# Altium schematic sheet 5R_Supply.doc.SchDoc: 5R Supply
size OrCAD A; DocumentNumber: LM-008; Revision: C; SheetNumber: 3; SheetTotal: 6
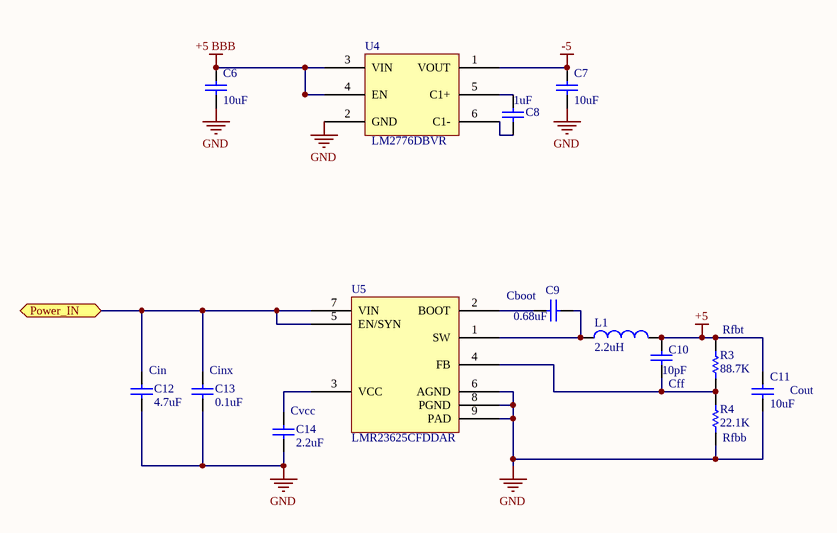
[diagram p0: 5R_Supply.doc.SchDoc]

## Parts
C6  10uF  [CAPC0805(2012)145_N]
C7  10uF  [CAPC0805(2012)145_N]
C8  1uF  [CAPC0805(2012)145_N]
C9  0.68uF  [1608[0603]]
C10  10pF  [CAPC0805(2012)145_N]
C11  10uF  [CAPC0805(2012)145_N]
C12  4.7uF  [C1210]
C13  0.1uF  [1608[0603]]
C14  2.2uF  [1608[0603]]
L1  2.2uH  [PA4332]
R3  88.7K  [RESC0805(2012)_M]
R4  22.1K  [RESC0805(2012)_M]
U4  LM2776DBVR  [LM2776DBVR]
U5  LMR23625CFDDAR  [LMR23625CDDAR]

## Ports
Power_IN

## Nets
+5: C10.1 C11.1 L1.2 R3.2
+5 BBB: C6.1 U4.3(VIN) U4.4(EN)
-5: C7.1 U4.1(VOUT)
GND: C6.2 C7.2 C11.2 C12.1 C13.1 C14.1 R4.1 U4.2(GND) U5.6(AGND) U5.8(PGND) U5.9(PAD)
Power_IN: C12.2 C13.2 U5.5(EN/SYN) U5.7(VIN) ; port Power_IN
NetC8_1: C8.1 U4.5(C1+)
NetC8_2: C8.2 U4.6(C1-)
NetC9_1: C9.1 U5.2(BOOT)
NetC9_2: C9.2 L1.1 U5.1(SW)
NetC10_2: C10.2 R3.1 R4.2 U5.4(FB)
NetC14_2: C14.2 U5.3(VCC)

## Notes on the sheet
- (near C9) Cboot
- (near R3) Rfbt
- (near C12) Cin
- (near C13) Cinx
- (near C10) Cff
- (near C11) Cout
- (near C14) Cvcc
- (near R4) Rfbb
- Title
- Size:
- Date:
- Orcad A
- Number:
- Time:
- Revision:
- Sheet
- of
- ZLS Corporation
- 7801 North Lamar Blvd.
- Suite E-184
- Austin, Texas 78752  USA
- (512) 453-0288
- File:

## Library data of the parts
C6 C7 C11 = CMP-1036-04795-1: CAP CER 10UF 16V X6S 0805; Manufacturer: TDK Corporation; Manufacturer Part Number: C2012X6S1C106K085AC; Tolerance: ±10%; Notification: Current market demand for these product types have resulted in fluctuating and extending lead times. Lead times may differ.; Supplier 1: Digi-Key; Supplier Part Number 1: 445-14483-6-ND; RoHS: RoHS Compliant; Category: Capacitors; Stock 1: 0; Pricing 1: 1=0.38, 10=0.259, 100=0.1466, 500=0.1035, 1000=0.09056 (USD); Packaging: Digi-Reel®; Part Status: Active; Voltage - Rated: 16V; Temperature Coefficient: X6S; Operating Temperature: -55°C ~ 105°C; Features: Low ESL; Ratings: -; Applications: General Purpose; Failure Rate: -; Mounting Type: Surface Mount, MLCC; Package / Case: 0805 (2012 Metric); Size / Dimension: 0.079" L x 0.049" W (2.00mm x 1.25mm); Height - Seated (Max): -; Thickness (Max): 0.039" (1.00mm); Lead Spacing: -; Lead Style: -; ComponentLink1URL: https://product.tdk.com/info/en/catalog/datasheets/mlcc_commercial_general_en.pdf; ComponentLink1Description: https://product.tdk.com/info/en/catalog/datasheets/mlcc_commercial_general_en.pdf
C8 = CMP-1036-04795-1: CAP CER 1UF 25V X7R 0805; Manufacturer: Yageo; Manufacturer Part Number: CC0805KKX7R6BB105; Tolerance: ±10%; Voltage - Rated: 10V; Notification: Current market demand for these product types have resulted in fluctuating and extending lead times. Lead times may differ.; Supplier 1: Digi-Key; Supplier Part Number 1: 311-1458-6-ND; RoHS: RoHS Compliant; Category: Capacitors; Stock 1: 30000; Pricing 1: 1=0.25, 10=0.168, 100=0.0852, 500=0.0583, 1000=0.05158 (USD); Packaging: Digi-Reel®; Part Status: Active; Temperature Coefficient: X7R; Operating Temperature: -55°C ~ 125°C; Features: -; Ratings: -; Applications: General Purpose; Failure Rate: -; Mounting Type: Surface Mount, MLCC; Package / Case: 0805 (2012 Metric); Size / Dimension: 0.079" L x 0.049" W (2.00mm x 1.25mm); Height - Seated (Max): -; Thickness (Max): 0.057" (1.45mm); Lead Spacing: -; Lead Style: -; ComponentLink1URL: http://www.yageo.com/documents/recent/UPY-GPHC_X7R_6.3V-to-50V_18.pdf; ComponentLink1Description: http://www.yageo.com/documents/recent/UPY-GPHC_X7R_6.3V-to-50V_18.pdf
C9 = Cap Semi: CAP CER 0.68UF 50V X5R 0603; Manufacturer: TDK Corporation; Manufacturer Part Number: C1608X5R1H684K080AB; Tolerance: ±10%; Notification: Current market demand for these product types have resulted in fluctuating and extending lead times. Lead times may differ.; Supplier 1: Digi-Key; Supplier Part Number 1: 445-7466-6-ND; RoHS: RoHS Compliant; Category: Capacitors; Stock 1: 40000; Pricing 1: 1=0.24, 10=0.162, 100=0.0819, 500=0.05606, 1000=0.04959 (USD); Packaging: Digi-Reel®; Part Status: Not For New Designs; Voltage - Rated: 50V; Temperature Coefficient: X5R; Operating Temperature: -55°C ~ 85°C; Features: Low ESL; Ratings: -; Applications: General Purpose; Failure Rate: -; Mounting Type: Surface Mount, MLCC; Package / Case: 0603 (1608 Metric); Size / Dimension: 0.063" L x 0.032" W (1.60mm x 0.80mm); Height - Seated (Max): -; Thickness (Max): 0.035" (0.90mm); Lead Spacing: -; Lead Style: -; ComponentLink1URL: https://product.tdk.com/info/en/catalog/datasheets/mlcc_commercial_general_en.pdf; ComponentLink1Description: https://product.tdk.com/info/en/catalog/datasheets/mlcc_commercial_general_en.pdf
C10 = CMP-1036-04795-1: CAP CER 10PF 16V C0G/NP0 0805; Manufacturer: KEMET; Manufacturer Part Number: C0805C100M4GACTU; Tolerance: ±20%; Temperature Coefficient: C0G, NP0; Notification: Current market demand for these product types have resulted in fluctuating and extending lead times. Lead times may differ.; Supplier 1: Digi-Key; Supplier Part Number 1: 399-9147-6-ND; RoHS: RoHS Compliant; Category: Capacitors; Stock 1: 7637; Pricing 1: 1=0.13, 10=0.092, 100=0.0409, 500=0.02918, 1000=0.02293 (USD); Packaging: Digi-Reel®; Part Status: Active; Voltage - Rated: 16V; Operating Temperature: -55°C ~ 125°C; Features: Low ESL; Ratings: -; Applications: General Purpose; Failure Rate: -; Mounting Type: Surface Mount, MLCC; Package / Case: 0805 (2012 Metric); Size / Dimension: 0.079" L x 0.049" W (2.00mm x 1.25mm); Height - Seated (Max): -; Thickness (Max): 0.035" (0.88mm); Lead Spacing: -; Lead Style: -; ComponentLink1URL: https://api.kemet.com/component-edge/download/datasheet/C0805C100M4GACTU.pdf; ComponentLink1Description: https://api.kemet.com/component-edge/download/datasheet/C0805C100M4GACTU.pdf
C12 = Cap Semi: CAP CER 4.7UF 50V X7R 1210; Manufacturer: Murata Electronics North America; Manufacturer Part Number: GRM32ER71H475KA88L; Tolerance: ±10%; Notification: Current market demand for these product types have resulted in fluctuating and extending lead times. Lead times may differ.; Published: 8-Jun-2000; LatestRevisionDate: 29-May-2009; LatestRevisionNote: IPC-7351 Footprint Added.; PackageReference: C1206; Publisher: Altium Limited; PackageDescription: Chip Capacitor; Supplier 1: Digi-Key; Supplier Part Number 1: 490-1864-6-ND; RoHS: RoHS Compliant; Category: Capacitors; Stock 1: 10000; Pricing 1: 1=1.66, 10=1.313, 100=0.9849, 500=0.74414 (USD); Packaging: Digi-Reel®; Part Status: Not For New Designs; Voltage - Rated: 50V; Temperature Coefficient: X7R; Operating Temperature: -55°C ~ 125°C; Features: -; Ratings: -; Applications: General Purpose; Mounting Type: Surface Mount, MLCC; Package / Case: 1210 (3225 Metric); Size / Dimension: 0.126" L x 0.098" W (3.20mm x 2.50mm); Height - Seated (Max): -; Thickness (Max): 0.106" (2.70mm); Lead Spacing: -; Lead Style: -; ComponentLink1URL: https://www.murata.com/~/media/webrenewal/support/library/catalog/products/capacitor/mlcc/c02e.ashx?la=en-us; ComponentLink1Description: https://www.murata.com/~/media/webrenewal/support/library/catalog/products/capacitor/mlcc/c02e.ashx?la=en-us
C13 = Cap Semi: CAP CER 0.1UF 50V X5R 0603; Manufacturer: TDK Corporation; Manufacturer Part Number: C1608X5R1H104K080AA; Tolerance: ±10%; Notification: Current market demand for these product types have resulted in fluctuating and extending lead times. Lead times may differ.; Supplier 1: Digi-Key; Supplier Part Number 1: 445-7456-6-ND; RoHS: RoHS Compliant; Category: Capacitors; Stock 1: 0; Pricing 1: 1=0.1, 10=0.074, 100=0.0331, 500=0.02366, 1000=0.0186 (USD); Packaging: Digi-Reel®; Part Status: Not For New Designs; Voltage - Rated: 50V; Temperature Coefficient: X5R; Operating Temperature: -55°C ~ 85°C; Features: Low ESL; Ratings: -; Applications: General Purpose; Failure Rate: -; Mounting Type: Surface Mount, MLCC; Package / Case: 0603 (1608 Metric); Size / Dimension: 0.063" L x 0.032" W (1.60mm x 0.80mm); Height - Seated (Max): -; Thickness (Max): 0.035" (0.90mm); Lead Spacing: -; Lead Style: -; ComponentLink1URL: https://product.tdk.com/info/en/catalog/datasheets/mlcc_commercial_general_en.pdf; ComponentLink1Description: https://product.tdk.com/info/en/catalog/datasheets/mlcc_commercial_general_en.pdf
C14 = Cap Semi: CAP CER 2.2UF 10V X7R 0603
L1 = Inductor: FIXED IND 2.2UH 4.3A 48 MOHM SMD; Manufacturer: Pulse Electronics Power; Manufacturer Part Number: PA4332.222NLT; Type: Wirewound; Material - Core: Iron; Tolerance: ±20%; Current - Saturation: 6.1A; Shielding: Shielded; DC Resistance (DCR): 48 mOhm Max; Frequency - Self Resonant: 25MHz; Supplier 1: Digi-Key; Supplier Part Number 1: 553-3290-6-ND; RoHS: RoHS Compliant; Category: Inductors, Coils, Chokes; Stock 1: 4798; Pricing 1: 1=0.64, 10=0.564, 100=0.4025, 500=0.3381, 1000=0.2737 (USD); Packaging: Digi-Reel®; Part Status: Active; Q @ Freq: -; Ratings: -; Operating Temperature: -40°C ~ 125°C; Features: -; Mounting Type: Surface Mount; Package / Case: Nonstandard; Supplier Device Package: -; Size / Dimension: 0.165" L x 0.165" W (4.20mm x 4.20mm); Height - Seated (Max): 0.079" (2.00mm); ComponentLink1URL: http://products.pulseelex.com/files/product_files/P761.pdf; ComponentLink1Description: http://products.pulseelex.com/files/product_files/P761.pdf
R3 = CMP-1013-00017-1: RES SMD 88.7K OHM 1% 1/8W 0805; Manufacturer: Vishay Dale; Manufacturer Part Number: CRCW080588K7FKEA; Power (Watts): 0.125W, 1/8W; Temperature Coefficient: ±100ppm/°C; Supplier 1: Digi-Key; Supplier Part Number 1: 541-88.7KCDKR-ND; RoHS: RoHS Compliant; Category: Resistors; Stock 1: 66; Pricing 1: 1=0.1, 10=0.055, 100=0.0223, 1000=0.01003, 2500=0.0087 (USD); Packaging: Digi-Reel®; Part Status: Active; Tolerance: ±1%; Composition: Thick Film; Features: Automotive AEC-Q200; Operating Temperature: -55°C ~ 155°C; Package / Case: 0805 (2012 Metric); Supplier Device Package: 0805; Size / Dimension: 0.079" L x 0.049" W (2.00mm x 1.25mm); Height - Seated (Max): 0.020" (0.50mm); Failure Rate: -; ComponentLink1URL: http://www.vishay.com/docs/20035/dcrcwe3.pdf; ComponentLink1Description: http://www.vishay.com/docs/20035/dcrcwe3.pdf
R4 = CMP-1013-00017-1: RES SMD 22.1K OHM 1% 1/8W 0805; Manufacturer: Vishay Dale; Manufacturer Part Number: CRCW080522K1FKEA; Power (Watts): 0.125W, 1/8W; Temperature Coefficient: ±100ppm/°C; Supplier 1: Digi-Key; Supplier Part Number 1: 541-22.1KCDKR-ND; RoHS: RoHS Compliant; Category: Resistors; Stock 1: 1994; Pricing 1: 1=0.1, 10=0.055, 100=0.0223, 1000=0.01003, 2500=0.0087 (USD); Packaging: Digi-Reel®; Part Status: Active; Tolerance: ±1%; Composition: Thick Film; Features: Automotive AEC-Q200; Operating Temperature: -55°C ~ 155°C; Package / Case: 0805 (2012 Metric); Supplier Device Package: 0805; Size / Dimension: 0.079" L x 0.049" W (2.00mm x 1.25mm); Height - Seated (Max): 0.020" (0.50mm); Failure Rate: -; ComponentLink1URL: http://www.vishay.com/docs/20035/dcrcwe3.pdf; ComponentLink1Description: http://www.vishay.com/docs/20035/dcrcwe3.pdf
U4 = LM2776DBVR: IC REG SWTCHD CAP INV 6SOT23; Manufacturer: Texas Instruments; Function: Ratiometric; Output Configuration: Negative; Topology: Charge Pump; Output Type: Fixed; Number of Outputs: 1; Voltage - Input (Min): 2.7V; Voltage - Input (Max): 5.5V; Voltage - Output (Min/Fixed): -Vin; Current - Output: 200mA; Frequency - Switching: 2MHz; Synchronous Rectifier: No; Supplier 1: Digi-Key; Supplier Part Number 1: 296-43957-6-ND; Manufacturer Part Number: LM2776DBVR; RoHS: RoHS Compliant; Category: Integrated Circuits (ICs); Stock 1: 13045; Pricing 1: 1=1.05, 10=0.936, 100=0.7297, 500=0.60276, 1000=0.47586 (USD); Packaging: Digi-Reel®; Part Status: Active; Voltage - Output (Max): -; Operating Temperature: -40°C ~ 85°C (TA); Mounting Type: Surface Mount; Package / Case: SOT-23-6; Supplier Device Package: SOT-23-6; ComponentLink1URL: http://www.ti.com/lit/ds/symlink/lm2776.pdf; ComponentLink1Description: http://www.ti.com/lit/ds/symlink/lm2776.pdf
U5 = LMR23625CDDAR: IC REG BUCK ADJ 2.5A SYNC 8SOPWR; Manufacturer: Texas Instruments; Function: Step-Down; Output Configuration: Positive; Output Type: Adjustable; Number of Outputs: 1; Voltage - Input (Min): 4.5V; Voltage - Input (Max): 36V; Voltage - Output (Min/Fixed): 1V; Voltage - Output (Max): 28V; Frequency - Switching: 2.1MHz; Synchronous Rectifier: Yes; Supplier 1: Digi-Key; Supplier Part Number 1: 296-47269-1-ND; Manufacturer Part Number: LMR23625CFDDAR; RoHS: RoHS Compliant; Category: Integrated Circuits (ICs); Stock 1: 2378; Pricing 1: 1=3.24, 10=2.912, 100=2.3861, 500=2.03124, 1000=1.7131 (USD); Packaging: Cut Tape (CT); Part Status: Active; Topology: Buck; Current - Output: 2.5A; Operating Temperature: -40°C ~ 125°C (TJ); Mounting Type: Surface Mount; Package / Case: 8-PowerSOIC (0.154", 3.90mm Width); Supplier Device Package: 8-SO PowerPad; ComponentLink1URL: http://www.ti.com/lit/ds/symlink/lmr23625.pdf; ComponentLink1Description: http://www.ti.com/lit/ds/symlink/lmr23625.pdf